# EAGLE design RGBdriverModuleOpAmp (EAGLE 4.16)
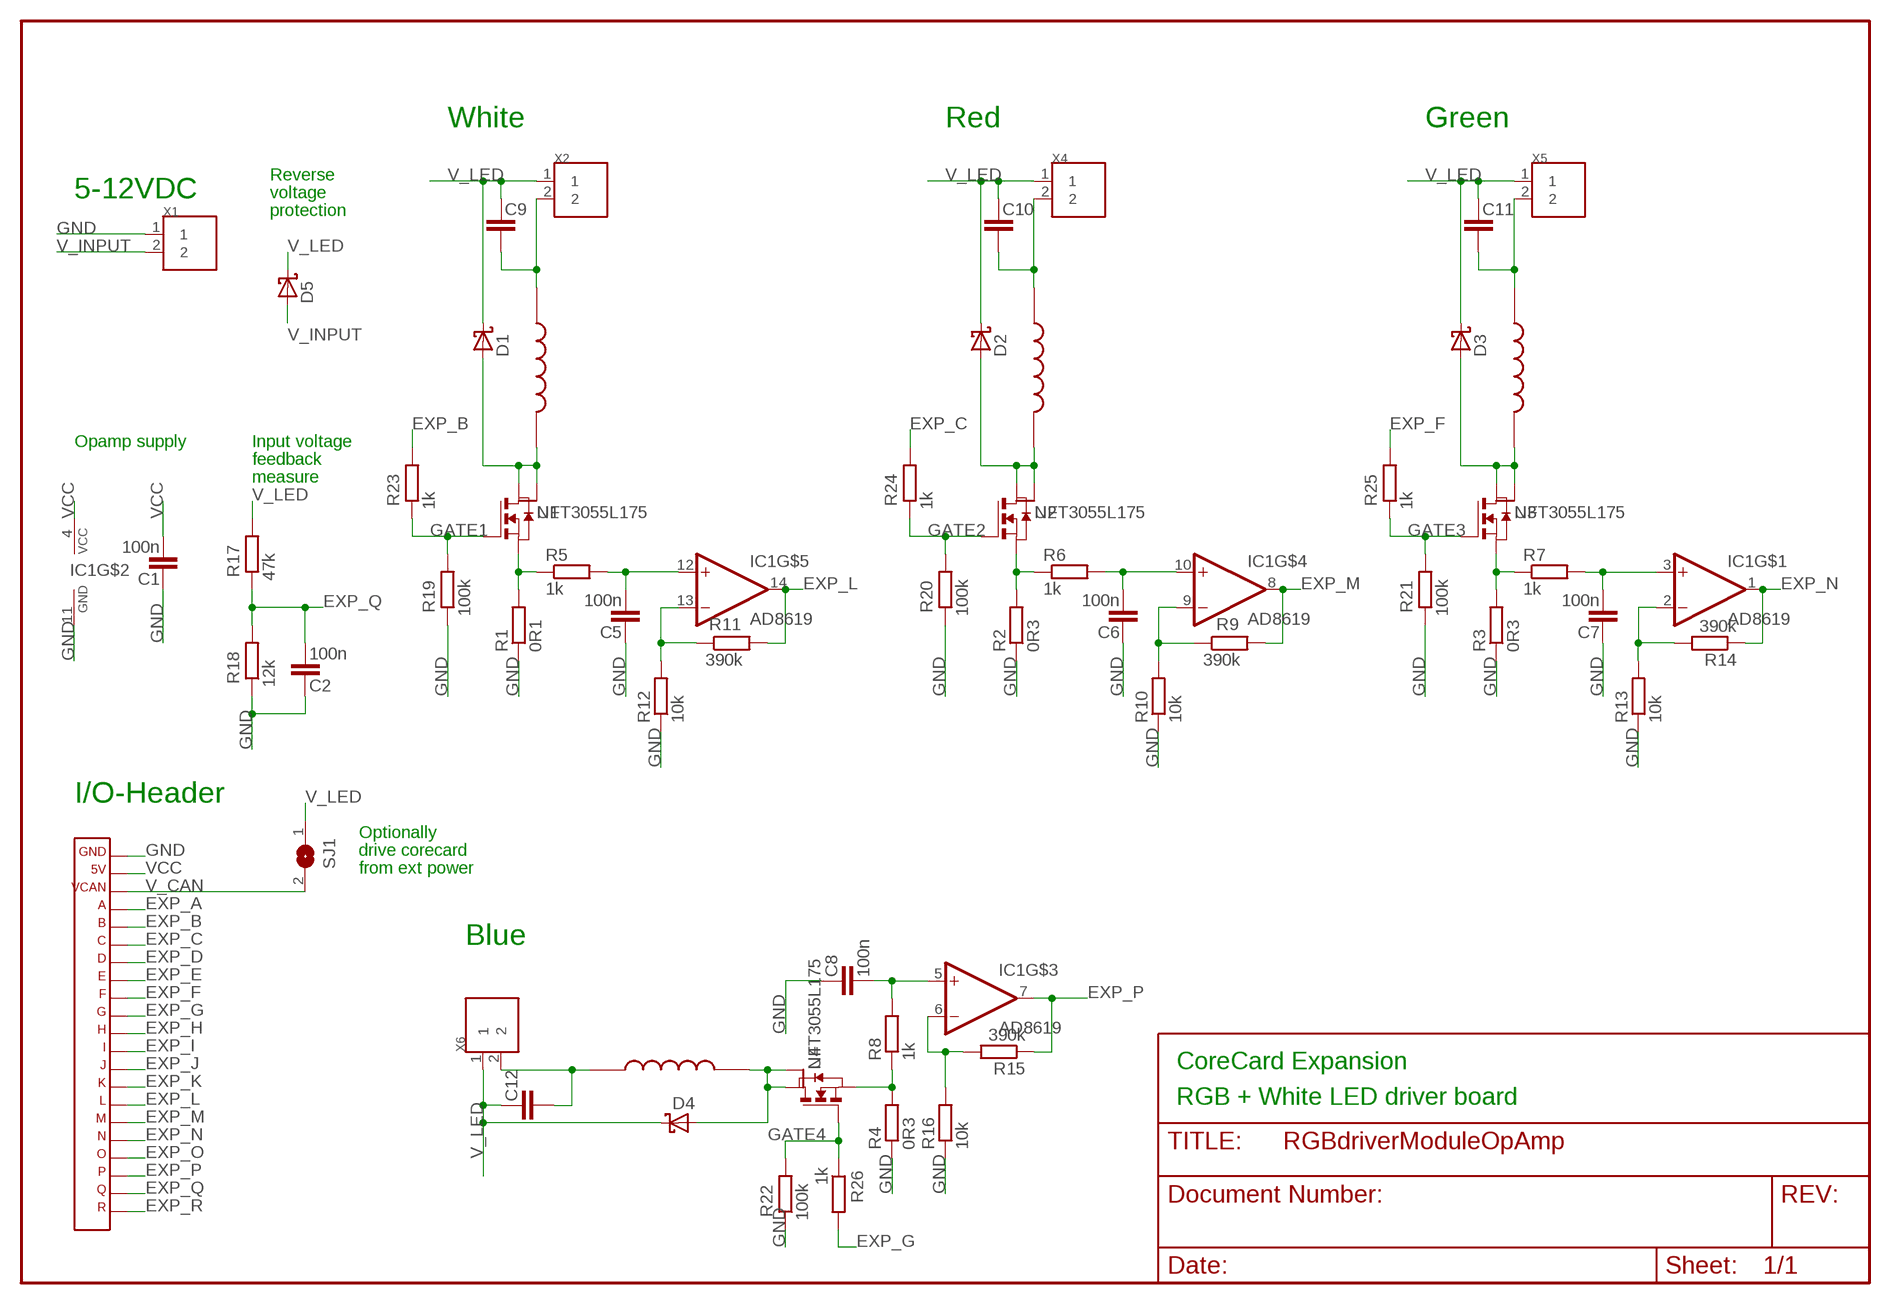
[diagram p0: schematic, sheet 1]

## Parts
C1  100n  C-EUC0603  [C0603]
C2  100n  C-EUC0603  [C0603]
C5  100n  C-EUC0603  [C0603]
C6  100n  C-EUC0603  [C0603]
C7  100n  C-EUC0603  [C0603]
C8  100n  C-EUC0603  [C0603]
C9  C-EUC1210  [C1210]
C10  C-EUC1210  [C1210]
C11  C-EUC1210  [C1210]
C12  C-EUC1210  [C1210]
D1  SCHOTTKY-DIODESMC  [SMC]
D2  SCHOTTKY-DIODESMC  [SMC]
D3  SCHOTTKY-DIODESMC  [SMC]
D4  SCHOTTKY-DIODESMC  [SMC]
D5  SCHOTTKY-DIODESMC  [SMC]
IC1  AD8619  [TSSOP14]
L1  10X10  [10X10]
L3  10X10  [10X10]
L4  10X10  [10X10]
L"  10X10  [10X10]
R1  0R1  R-EUR1206  [R1206]
R2  0R3  R-EUR1206  [R1206]
R3  0R3  R-EUR1206  [R1206]
R4  0R3  R-EUR1206  [R1206]
R5  1k  R-EUR0603  [R0603]
R6  1k  R-EUR0603  [R0603]
R7  1k  R-EUR0603  [R0603]
R8  1k  R-EUR0603  [R0603]
R9  390k  R-EUR0603  [R0603]
R10  10k  R-EUR0603  [R0603]
R11  390k  R-EUR0603  [R0603]
R12  10k  R-EUR0603  [R0603]
R13  10k  R-EUR0603  [R0603]
R14  390k  R-EUR0603  [R0603]
R15  390k  R-EUR0603  [R0603]
R16  10k  R-EUR0603  [R0603]
R17  47k  R-EUR0603  [R0603]
R18  12k  R-EUR0603  [R0603]
R19  100k  R-EUR0603  [R0603]
R20  100k  R-EUR0603  [R0603]
R21  100k  R-EUR0603  [R0603]
R22  100k  R-EUR0603  [R0603]
R23  1k  R-EUR0603  [R0603]
R24  1k  R-EUR0603  [R0603]
R25  1k  R-EUR0603  [R0603]
R26  1k  R-EUR0603  [R0603]
SJ1  SJ_NO  [SJ_NO]
U1  NFT3055L175  [SOT223]
U2  NFT3055L175  [SOT223]
U3  NFT3055L175  [SOT223]
U4  NFT3055L175  [SOT223]
X1  BLOCK2  [PCB2]
X2  BLOCK2  [PCB2]
X3  CORE_IOHEADEXP  [CORE_IOHEAD_NOSILC]
X4  BLOCK2  [PCB2]
X5  BLOCK2  [PCB2]
X6  BLOCK2  [PCB2]

## Nets
EXP_A: X3.4
EXP_B: R23.2 X3.5
EXP_C: R24.2 X3.6
EXP_D: X3.7
EXP_E: X3.8
EXP_F: R25.2 X3.9
EXP_G: R26.2 X3.10
EXP_H: X3.11
EXP_I: X3.12
EXP_J: X3.13
EXP_K: X3.14
EXP_L: IC1.14(OUT) R11.2 X3.15
EXP_M: IC1.8(OUT) R9.2 X3.16
EXP_N: IC1.1(OUT) R14.1 X3.17
EXP_O: X3.18
EXP_P: IC1.7(OUT) R15.1 X3.19
EXP_Q: C2.2 R17.1 R18.2 X3.20
EXP_R: X3.21
GATE1: R19.2 R23.1 U1.1(G)
GATE2: R20.2 R24.1 U2.1(G)
GATE3: R21.2 R25.1 U3.1(G)
GATE4: R22.2 R26.1 U4.1(G)
GND: C1.1 C2.1 C5.1 C6.1 C7.1 C8.1 IC1.11(GND) R1.1 R2.1 R3.1 R4.1 R10.1 R12.1 R13.1 R16.1 R18.1 R19.1 R20.1 R21.1 R22.1 X1.1 X3.1
L1: D1.A L1.P$2 U1.2(D) U1.4(D_PAD)
L2: D2.A L".P$2 U2.2(D) U2.4(D_PAD)
L3: D3.A L3.P$2 U3.2(D) U3.4(D_PAD)
L4: D4.A L4.P$2 U4.2(D) U4.4(D_PAD)
N$1: R1.2 R5.1 U1.3(S)
N$2: R2.2 R6.1 U2.3(S)
N$4: C10.2 L".P$1 X4.2
N$5: C9.2 L1.P$1 X2.2
N$7: R3.2 R7.1 U3.3(S)
N$8: C11.2 L3.P$1 X5.2
N$11: C12.2 L4.P$1 X6.2
N$12: C5.2 IC1.12(+IN) R5.2
N$13: IC1.9(-IN) R9.1 R10.2
N$14: C6.2 IC1.10(+IN) R6.2
N$15: C7.2 IC1.3(+IN) R7.2
N$16: IC1.13(-IN) R11.1 R12.2
N$17: IC1.2(-IN) R13.2 R14.2
N$18: C8.2 IC1.5(+IN) R8.2
N$20: IC1.6(-IN) R15.2 R16.2
SHUNT4: R4.2 R8.1 U4.3(S)
V_CAN: SJ1.2 X3.3
V_INPUT: D5.A X1.2
V_LED: C9.1 C10.1 C11.1 C12.1 D1.C D2.C D3.C D4.C D5.C R17.2 SJ1.1 X2.1 X4.1 X5.1 X6.1
VCC: C1.2 IC1.4(VCC) X3.2

## Notes on the sheet
- White | Red | Green
- Reverse
- 5-12VDC | voltage
- protection
- Opamp supply | Input voltage
- feedback
- measure
- I/O-Header
- Optionally
- drive corecard
- from ext power
- Blue
- CoreCard Expansion
- RGB + White LED driver board

## Library data of the parts
C1 C2 C5-C12 = rcl:C-EU
D1-D5 = diode:SCHOTTKY-DIODE
IC1 = ad8619:AD8619
L1 L3 L4 L" = inductor10x10:10X10
R1-R26 = rcl:R-EU
SJ1 = jumper:SJ_NO
U1-U4 = NMOS_NTF3055L175:NFT3055L175
X1 X2 X4-X6 = terminal_block:BLOCK2
X3 = expboard:CORE_IOHEAD: CoreCard IO-header for expansion cards

## Board
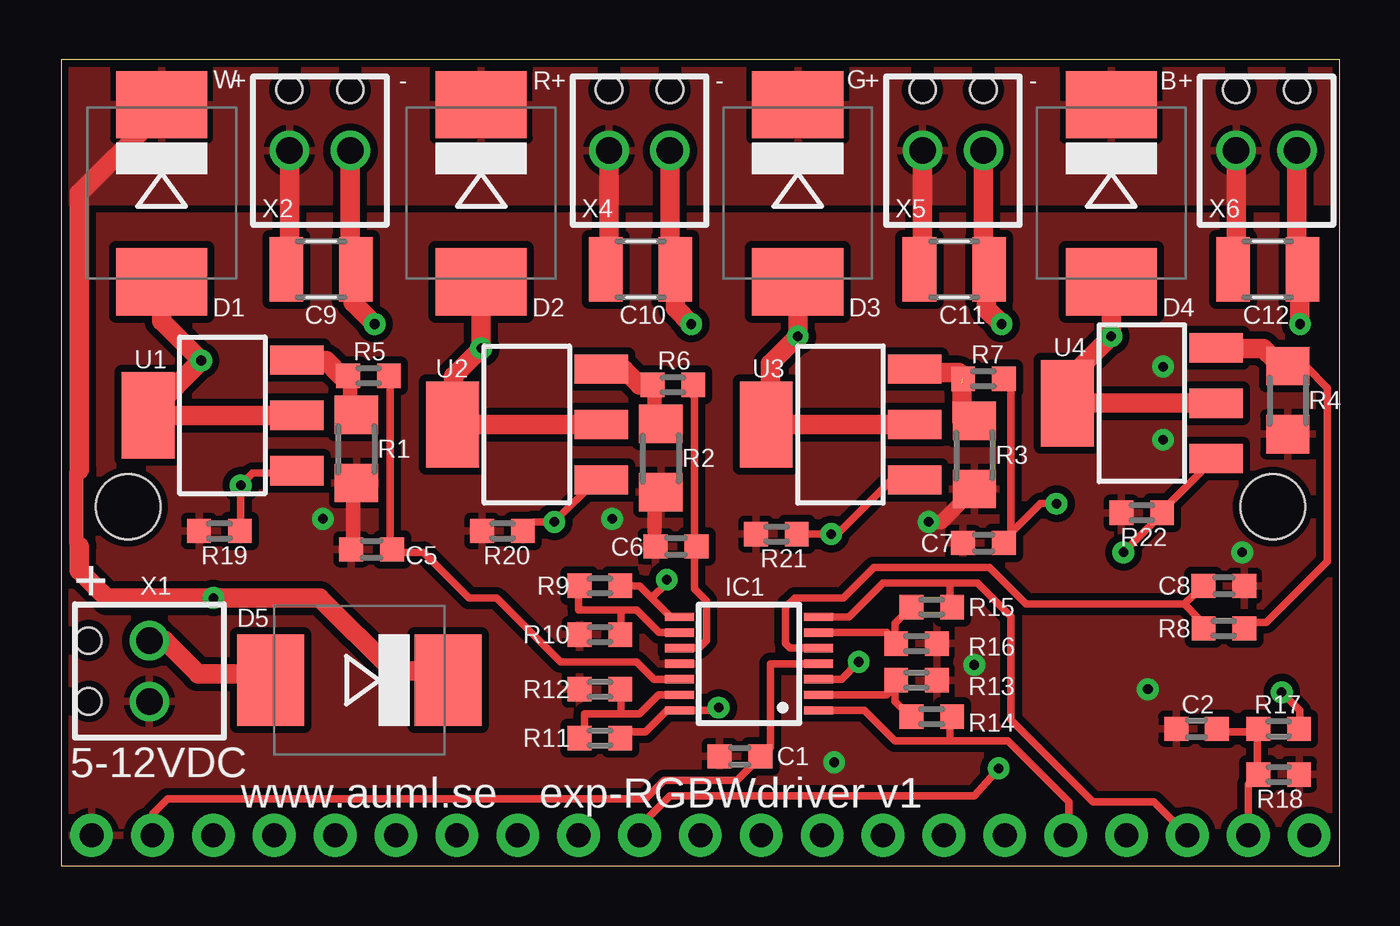
[diagram p1: board, top side]
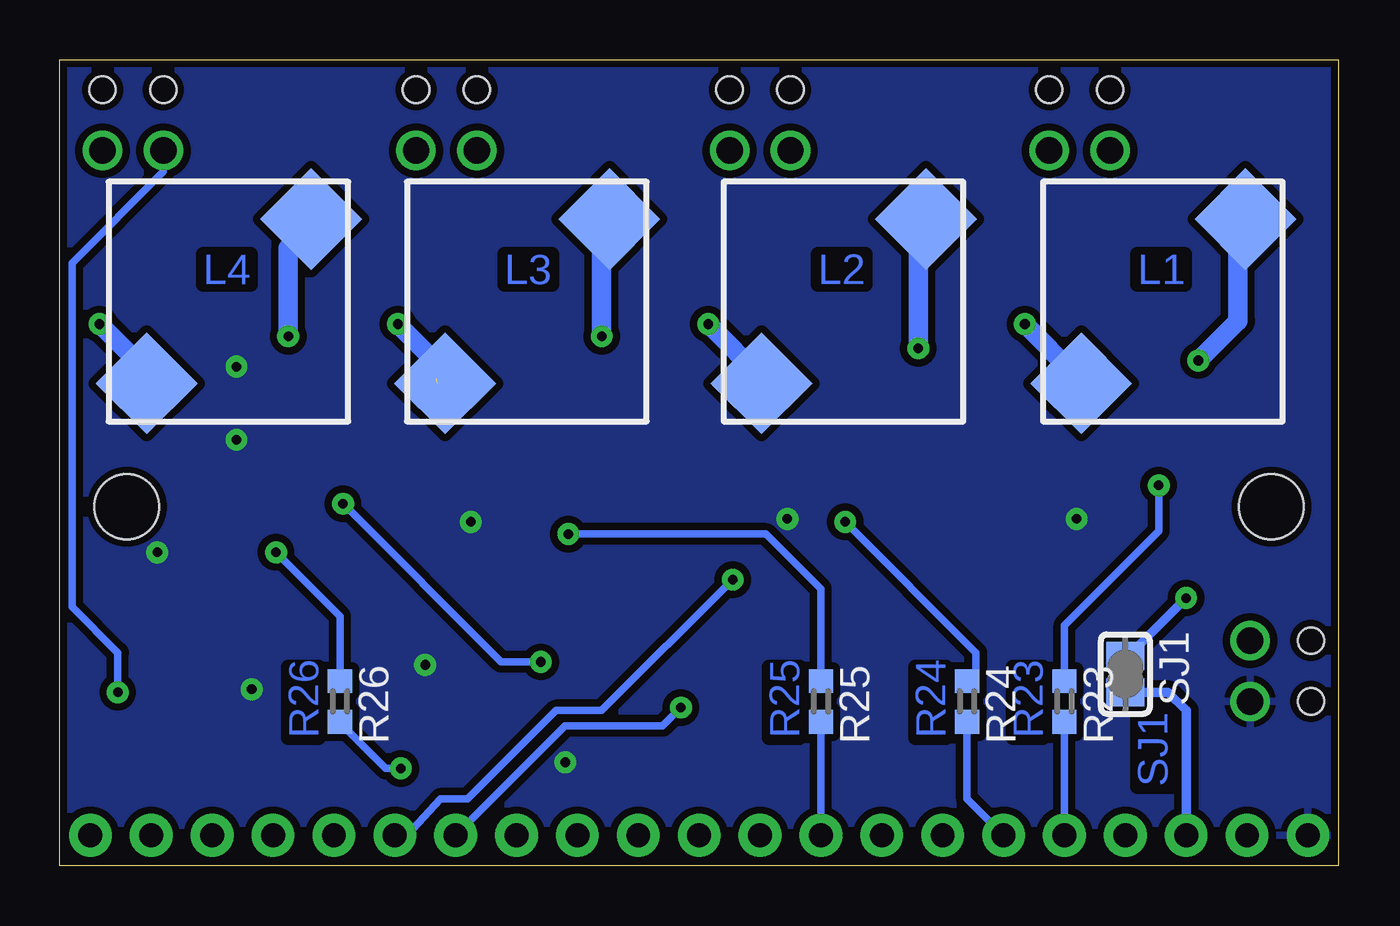
[diagram p2: board, bottom side, seen from below]

Size 53.34 x 33.63 mm. Coordinates in mm from the lower left corner, seen from the top.
Outline: 0,0 53.34,0 53.34,33.63 0,33.63 0,0
Copper layers (1*16): Top 0.035mm / dielectric 1.5mm / Bottom 0.035mm
Design rules "default": minimum track width 10mil, minimum drill 0.4mm, track to track 10mil, track to pad 10mil, pad to pad 10mil, via to via 10mil, smd to smd 8mil, copper to edge 10mil, drill to drill 8mil, minimum pad ring 10mil, minimum via ring 10mil, stop-mask expansion 4mil, vias tented up to drill 18mil, thermal gap 10mil
Holes 2.7 mm at 2.79,14.99 50.55,14.99

### Footprints (pad centres in the part's own frame; a part is rotated, then mirrored left to right if it is on the bottom)
C0603 = smd 1 x 1: 1 -0.85,0; 2 0.85,0
C1210 = smd 1.4 x 2.7: 1 -1.4,0; 2 1.5,0
SMC = smd 2.8 x 3.8: A 3.7,0; C -3.7,0
TSSOP14 = smd 0.35 x 1.2: 1 -2.025,-2.9; 2 -1.375,-2.9; 3 -0.725,-2.9; 4 -0.075,-2.9; 5 0.575,-2.9; 6 1.225,-2.9; 7 1.875,-2.9; 8 1.875,2.9; 9 1.225,2.9; 10 0.575,2.9; 11 -0.075,2.9; 12 -0.725,2.9; 13 -1.375,2.9; 14 -2.025,2.9
10X10 = smd 3 x 3 rotated 45: P$1 1.588,1.588; P$2 8.447,8.447
R1206 = smd 1.6 x 1.803: 1 -1.422,0; 2 1.422,0
R0603 = smd 0.991 x 1.016: 1 -0.85,0; 2 0.85,0
SJ_NO = smd 1.168 x 1.6: 1 -0.762,0; 2 0.762,0
SOT223 = smd 1.219 x 2.235: 1 -2.311,-3.099; 2 0,-3.099; 3 2.311,-3.099 | smd 3.6 x 2.2: 4 0,3.099
PCB2 = drill 1.1 round: 1 -2.54,0; 2 0,0 | hole 1.1: -2.54,2.54; 0,2.54
CORE_IOHEAD_NOSILC = drill 1 pad 1.778 round: 1 25.4,0; 2 22.86,0; 3 20.32,0; 4 17.78,0; 5 15.24,0; 6 12.7,0; 7 10.16,0; 8 7.62,0; 9 5.08,0; 10 2.54,0; 11 0,0; 12 -2.54,0; 13 -5.08,0; 14 -7.62,0; 15 -10.16,0; 16 -12.7,0; 17 -15.24,0; 18 -17.78,0; 19 -20.32,0; 20 -22.86,0; 21 -25.4,0

### Placement (x,y rotation side)
C1  28.32,4.57 0 top
C2  47.37,5.71 0 top
C5  12.95,13.21 0 top
C6  25.65,13.34 0 top
C7  38.48,13.46 0 top
C8  48.51,11.68 180 top
C9  10.79,24.89 0 top
C10  24.13,24.89 0 top
C11  37.21,24.89 0 top
C12  50.29,24.89 0 top
D1  4.19,28.07 270 top
D2  17.53,28.07 270 top
D3  30.73,28.07 270 top
D4  43.81,28.07 270 top
D5  12.45,7.75 180 top
IC1  28.7,8.51 90 top
L1  12.32,18.54 0 bottom
L3  38.86,18.54 0 bottom
L4  51.31,18.54 0 bottom
L"  25.65,18.54 0 bottom
R1  12.32,17.4 90 top
R2  25.02,17.02 90 top
R3  38.1,17.14 90 top
R4  51.18,19.43 90 top
R5  12.83,20.45 0 top
R6  25.53,20.07 0 top
R7  38.48,20.32 0 top
R8  48.51,9.91 180 top
R9  22.48,11.68 0 top
R10  22.48,9.65 0 top
R11  22.48,5.33 0 top
R12  22.48,7.37 0 top
R13  35.69,7.75 180 top
R14  36.32,6.22 180 top
R15  36.32,10.79 180 top
R16  35.69,9.27 180 top
R17  50.8,5.71 0 top
R18  50.8,3.81 180 top
R19  6.6,13.97 0 top
R20  18.41,13.97 0 top
R21  29.84,13.84 0 top
R22  45.09,14.73 0 top
R23  11.43,6.86 270 bottom
R24  15.49,6.86 270 bottom
R25  21.59,6.86 270 bottom
R26  41.66,6.86 270 bottom
SJ1  8.89,8 270 bottom
U1  6.73,18.8 90 top
U2  19.43,18.41 90 top
U3  32.51,18.41 90 top
U4  45.09,19.3 90 top
X1  3.68,9.4 90 top
X2  12.06,29.84 0 top
X3  26.67,1.27 0 bottom
X4  25.4,29.84 0 top
X5  38.48,29.84 0 top
X6  51.56,29.84 0 top

### Tracks (layer width: path | path; a pad name or v marks a point on that pad's centre or on a via)
EXP_B
  Bottom 0.305: X3.5 R23.2
EXP_C
  Bottom 0.305: X3.6 15.49,2.79 R24.2
EXP_F
  Bottom 0.305: X3.9 R25.2
EXP_G  (via drill 0.4)
  Top 0.305: v39.12,4.06 38.1,2.92 25.4,2.92 24.13,1.65 X3.10
  Bottom 0.305: X3.10 24.13,1.14 | R26.2 41.66,5.97 39.75,4.06 v39.12,4.06
EXP_L  (via drill 0.4)
  Top 0.305: R11.2 23.37,5.21 23.5,5.59 24.38,5.59 25.28,6.48 IC1.14 25.9,6.48 25.91,6.48 27.3,6.48 v27.43,6.6
  Bottom 0.305: X3.15 32.26,5.84 28.19,5.84 v27.43,6.6
EXP_M  (via drill 0.4)
  Top 0.305: IC1.8 25.42,10.39 24.64,11.18 | 24.64,11.18 24.13,11.68 R9.2 | v25.27,11.94 25.27,11.81 24.64,11.18
  Bottom 0.305: X3.16 38.86,1.27 37.47,2.79 36.32,2.79 32.64,6.48 30.73,6.48 v25.27,11.94
EXP_N
  Top 0.305: IC1.1 33.52,6.48 34.8,5.21 37.08,5.21 | 37.08,5.21 39.5,5.21 42.04,2.67 42.04,1.4 X3.17 | R14.1 37.08,5.88 37.08,5.21
EXP_P
  Top 0.305: 37.08,11.81 34.29,11.81 32.86,10.38 IC1.7 | 37.08,11.81 38.23,11.81 39.62,10.41 39.62,6.1 43.05,2.67 45.59,2.67 X3.19 | R15.1 37.08,11.01 37.08,11.81
EXP_Q
  Top 0.305: C2.2 48.35,5.59 49.91,5.59 | R17.1 49.91,5.68 49.91,5.59 | 49.91,5.59 49.91,3.81 R18.2 49.53,3.39 X3.20
GATE1  (via drill 0.4)
  Top 0.305: 9.53,16.82 U1.1 9.88,16.48 | R19.2 7.49,13.97 v7.49,15.88 8,16.38 9.78,16.38 9.88,16.48 | 9.88,16.48 9.91,16.51
  Bottom 0.305: R23.1 11.43,10.03 7.49,13.97 v7.49,15.88
GATE2  (via drill 0.4)
  Top 0.305: R20.2 19.3,13.97 19.68,14.35 v20.57,14.35 22.35,16.13 22.38,16.1 U2.1
  Bottom 0.305: R24.1 15.37,7.75 15.11,8 15.11,8.89 v20.57,14.35
GATE3  (via drill 0.4)
  Top 0.305: R21.2 v32.13,13.84 32.38,13.84 34.67,16.13 35.56,16.13 35.59,16.1 U3.1
  Bottom 0.305: R25.1 21.59,11.56 23.88,13.84 v32.13,13.84
GATE4  (via drill 0.4)
  Top 0.305: v44.32,13.08 45.85,14.61 R22.2 45.85,14.73 48.11,16.99 U4.1
  Bottom 0.305: R26.1 41.66,10.41 v44.32,13.08
GND  (via drill 0.4)
  Top 0.305: R2.1 24.77,15.24 24.89,15.37
  Top 0.61: 24.77,13.97 24.77,15.24 | 12.19,15.85 12.19,14.99 | 12.19,15.85 R1.1 | 12.06,13.08 12.19,13.08 12.19,15.85 | R3.1 36.73,14.35 v36.2,14.35
  other vias: 38.1,8.38 49.28,13.08 10.92,14.48 22.99,14.48 32.26,4.32 45.34,7.37 45.97,17.78 45.97,20.83
  pour Bottom (isolate 0.305, rank 3): 0,33.63 53.34,33.63 53.34,1.14 0,1.14
  pour Top (isolate 0.305, rank 3): 0,27.41 53.34,27.41 53.34,1.14 0,1.14
L1  (via drill 0.4)
  Top 0.61: 3.81,19.05 3.76,18.72 U1.4
  Top 0.813: U1.4 U1.2 | D1.A 4.19,22.73 v5.84,21.08 3.81,19.05
  Bottom 0.61: 4.19,26.67 L1.P$2
  Bottom 0.813: v5.84,21.08 4.19,22.73 4.19,26.67
L2  (via drill 0.4)
  Top 0.61: U2.4 16.51,18.41
  Top 0.813: U2.2 16.51,18.41 16.38,18.54 16.38,20.45 v17.53,21.59 D2.A
  Bottom 0.61: L".P$2 17.27,26.67 17.53,26.54
  Bottom 0.813: v17.53,21.59 17.53,26.54
L3  (via drill 0.4)
  Top 0.61: U3.4 29.72,18.41
  Top 0.813: U3.2 29.72,18.41 29.59,18.54 29.59,20.95 v30.73,22.1 D3.A
  Bottom 0.61: 30.35,25.91 L3.P$2 30.61,26.8 30.73,26.8
  Bottom 0.813: v30.73,22.1 30.73,26.8
L4  (via drill 0.4)
  Top 0.61: U4.4 42.16,19.3 42.16,19.43
  Top 0.813: D4.A v43.81,22.1 42.29,20.57 42.29,20.19 42.16,19.43 | 42.16,19.3 U4.2
  Bottom 0.61: 43.81,25.78 43.69,25.78 L4.P$2
  Bottom 0.813: v43.81,22.1 43.81,25.78
N$1
  Top 0.61: U1.3 9.37,20.98 9.4,20.95 11.05,21.08 | 11.68,20.45 R5.1 12.06,20.45 12.06,18.82 R1.2
  Top 0.813: 11.68,20.45 11.05,21.08
N$2
  Top 0.61: U2.3 22.58,20.73 22.61,20.7 23.5,20.7 | R6.1 24.77,19.56 24.77,18.19 R2.2
  Top 0.813: 23.5,20.7 24.13,20.07 R6.1
N$4  (via drill 0.4)
  Top 0.61: 25.4,25.65 25.65,25.4 C10.2
  Top 0.813: 25.4,25.65 X4.2 | C10.2 25.63,23.27 v26.29,22.61
  Bottom 0.61: 24.26,19.94 24.26,19.81 24.13,19.94 L".P$1 24,19.18
  Bottom 0.813: 24,19.18 24,20.32 v26.29,22.61
N$5  (via drill 0.4)
  Top 0.61: C9.2 12.19,25.15 12.06,25.27
  Top 0.813: 12.06,25.27 X2.2 | 12.19,25.15 12.19,23.5 v13.08,22.61
  Bottom 0.61: L1.P$1 10.67,19.18 10.67,19.3
  Bottom 0.813: 10.67,19.3 10.79,20.45 10.92,20.45 v13.08,22.61
N$7  (1 unrouted)
  Top 0.61: U3.3 35.79,20.73 35.81,20.7 | 37.59,18.57 R3.2
  Top 0.813: 37.59,18.57 37.59,20.15 | 35.81,20.7 36.32,20.7 36.45,20.57 37.47,20.57 37.47,20.49 R7.1
N$8  (via drill 0.4)
  Top 0.61: C11.2 38.61,25.27 38.48,25.4
  Top 0.813: 38.48,25.4 X5.2 | 38.61,25.27 38.61,23.24 v39.24,22.61
  Bottom 0.61: 37.27,19.75 L3.P$1 37.21,19.05 | 37.21,19.05 37.21,18.92 | 37.21,19.05 37.08,19.3
  Bottom 0.813: 37.08,19.3 37.08,20.45 v39.24,22.61
N$11  (via drill 0.4)
  Top 0.61: 51.56,25.15 51.69,24.77 51.74,25.07 C12.2
  Top 0.813: 51.56,25.15 X6.2 | v51.69,22.61 51.69,24.77
  Bottom 0.61: L4.P$1 50.42,19.18 50.42,20.32
  Bottom 0.813: 50.42,20.32 50.16,20.32 50.16,21.08 v51.69,22.61
N$12
  Top 0.305: R5.2 13.68,20.49 13.72,20.19 13.72,13.21 | 13.8,13.25 13.72,13.21 | 13.8,13.25 C5.2 13.8,13.12 13.84,13.08 15.11,13.08 17.02,11.18 18.16,11.18 20.83,8.51 24,8.51 24.73,7.78 IC1.12 | 13.72,13.21 13.72,13.08 13.8,13.25
N$13
  Top 0.305: R9.1 21.59,11.68 21.59,10.67 23.37,10.67 | IC1.9 24.94,9.73 24,10.67 23.37,10.67 | R10.2 23.37,9.69 23.37,10.67
N$14
  Top 0.305: R6.2 26.38,19.6 26.42,19.56 26.42,13.46 | IC1.10 26.61,9.08 26.92,9.4 26.92,11.05 26.42,11.56 26.42,13.46 | 26.42,13.46 C6.2
N$15  (via drill 0.4)
  Top 0.305: 39.62,19.94 39.46,20.11 R7.2 39.62,19.94 | IC1.3 32.55,7.78 v33.27,8.51 | 39.62,13.88 C7.2 | 39.62,13.88 39.62,19.94 | 39.62,13.88 40.85,15.11 v41.53,15.11
  Bottom 0.305: v33.27,8.51 34.92,8.51 v41.53,15.11
N$16
  Top 0.305: R11.1 21.63,5.29 21.84,5.33 21.84,6.35 23.37,6.35 | IC1.13 24.91,7.13 24.13,6.35 23.37,6.35 | R12.2 23.37,7.33 23.37,6.35
N$17
  Top 0.305: IC1.2 34.44,7.13 34.8,7.49 | R14.2 35.43,6.22 34.8,6.86 34.8,7.49 | 34.8,7.49 R13.2
N$18
  Top 0.305: IC1.5 30.41,9.08 30.23,9.27 30.23,10.79 30.61,11.18 32.64,11.18 33.91,12.45 38.73,12.45 40.26,10.92 46.86,10.92 | 46.86,10.92 C8.2 | R8.2 47.54,10.03 47.5,10.03 47.5,10.29 46.86,10.92
N$20
  Top 0.305: 34.8,9.53 34.84,9.49 R16.2 34.8,9.4 | 34.8,9.4 34.54,9.65 | IC1.6 34.46,9.73 34.8,9.4 | R15.2 34.8,10.12 34.8,9.4
SHUNT4
  Top 0.305: R8.1 49.49,10.03 49.53,10.03 49.66,10.16 50.29,10.16 52.83,12.7 52.83,19.94 51.94,20.83 51.18,20.83 R4.2
  Top 0.813: R4.2 50.95,21.08 50.67,21.08 50.16,21.59 48.21,21.59 U4.3
V_CAN
  Bottom 0.406: SJ1.2 7.11,7.24 6.35,6.48 X3.3
V_INPUT
  Top 0.813: X1.2 4.32,9.4 5.71,8 8.51,8 8.51,7.98 D5.A
V_LED  (via drill 0.4)
  Top 0.305: R17.2 51.69,5.71 51.69,6.48 v50.93,7.24
  Top 0.61: 0.76,13.34 0.64,13.46 0.64,16.38 0.76,16.51 | D1.C 4.19,31.11 3.81,31.11 | C9.1 9.27,25.15 9.53,25.4 | C10.1 22.73,25.4 22.86,25.53 | C11.1 35.81,25.4 35.94,25.53 | C12.1 48.84,25.07 48.9,25.02 49.02,25.15
  Top 0.813: 0.76,13.34 0.76,12.32 1.91,11.18 v6.35,11.18 10.79,11.18 13.84,8.13 16,8.13 16,8.14 D5.C | 0.76,16.51 0.76,28.07 3.81,31.11 | 9.53,25.4 X2.1 | 22.86,25.53 X4.1 | 35.94,25.53 X5.1 | X6.1 49.02,25.15
  Bottom 0.305: v50.93,7.24 50.93,8.89 52.83,10.79 52.83,25.15 49.02,28.96 X6.1
  Bottom 0.406: SJ1.1 8.76,8.76 v6.35,11.18
  pour Top (isolate 0.305): 0,33.63 53.34,33.63 53.34,27.71 0,27.71
VCC
  Top 0.305: X3.2 3.81,2.16 4.45,2.79 24.38,2.79 25.15,3.56 28.19,3.56 29.59,4.95 | IC1.4 29.59,8.43 29.59,4.95 | 29.59,4.95 29.34,4.7 C1.2

### Text on the board
Bottom: L1 | L2 | L3 | L4 | R23 | R24 | R25 | R26 | SJ1
tPlace: W | + | - | R | + | - | G | + | - | B | + | + | 5-12VDC | www.auml.se | exp-RGBWdriver v1
Document: Corecard edge | Top is component side | Expansion will be mounted bottom to bottom with CoreCard | Change vertical dimension to fit | Remove I/O-header silcscreen if neccesary | Remove mounting holes if neccesary
tDocu: A | B | C | D | E | F | G | H | I | J | K | L | M | N | O | P | Q | R